# EAGLE schematic chamber_biasa (EAGLE 7.6.0)
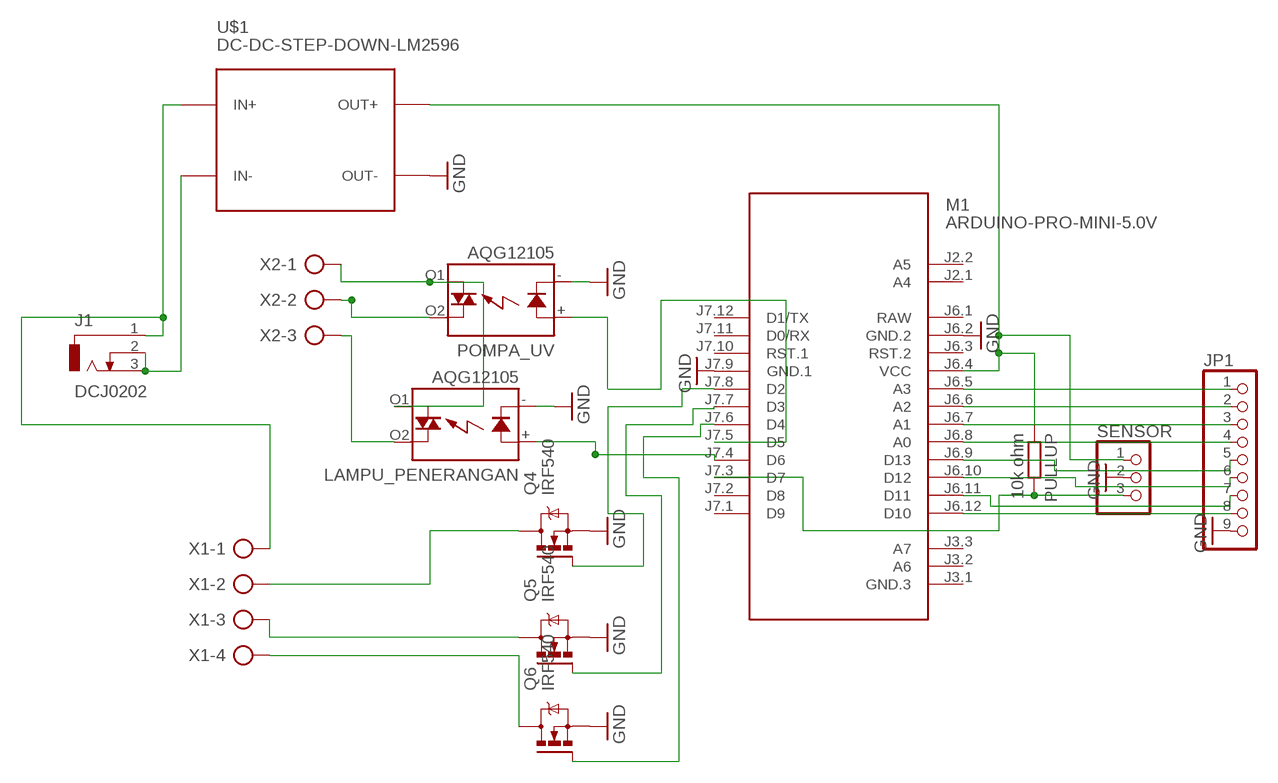
[diagram p0: schematic, sheet 1]

## Parts
J1  DCJ0202  [DCJ0202]
JP1  PINHD-1X9  [1X09]
LAMPU_PENERANGAN  AQG12105  [AQG]
M1  ARDUINO-PRO-MINI-5.0V  [ARDUINO-PRO-MINI]
POMPA_UV  AQG12105  [AQG]
PULLUP  10k ohm  R-EU_0204/7  [0204/7]
Q4  IRF540  [TO220BV]
Q5  IRF540  [TO220BV]
Q6  IRF540  [TO220BV]
SENSOR  PINHD-1X3  [1X03]
U$1  DC-DC-STEP-DOWN-LM2596  [DC-DC-STEP-DOWN-LM2596]
X1  AK300/4  [AK300/4]
X2  AK300/3  [AK300/3]

## Nets
5V: M1.J6.4(VCC) PULLUP.1 SENSOR.1 U$1.OUT+
GND: JP1.9 LAMPU_PENERANGAN.-(K) M1.J6.2(GND.2) M1.J7.9(GND.1) POMPA_UV.-(K) Q4.S Q5.S Q6.S SENSOR.2 U$1.OUT-
N$1: LAMPU_PENERANGAN.+(A) M1.J7.4(D6)
N$2: M1.J7.8(D2) Q4.G
N$3: M1.J7.5(D5) POMPA_UV.+(A)
N$4: M1.J7.7(D3) Q5.G
N$5: M1.J7.6(D4) Q6.G
N$6: Q4.D X1.2
N$7: Q5.D X1.3
N$8: Q6.D X1.4
N$9: J1.2 J1.3 U$1.IN-
N$10: J1.1 U$1.IN+ X1.1
N$11: POMPA_UV.O2(DS1) X2.2
N$12: LAMPU_PENERANGAN.O1(DS2) POMPA_UV.O1(DS2) X2.1
N$13: LAMPU_PENERANGAN.O2(DS1) X2.3
N$14: JP1.1 M1.J6.5(A3)
N$15: M1.J7.3(D7) PULLUP.2 SENSOR.3
N$16: JP1.2 M1.J6.6(A2)
N$17: JP1.3 M1.J6.7(A1)
N$18: JP1.4 M1.J6.8(A0)
N$19: JP1.5 M1.J6.9(D13)
N$20: JP1.6 M1.J6.10(D12)
N$21: JP1.7 M1.J6.11(D11)
N$22: JP1.8 M1.J6.12(D10)
Unconnected: M1.J2.1(A4) M1.J2.2(A5) M1.J3.1(GND.3) M1.J3.2(A6) M1.J3.3(A7) M1.J6.3(RST.2) M1.J7.1(D9) M1.J7.2(D8) M1.J7.10(RST.1) M1.J7.11(D0/RX) M1.J7.12(D1/TX)

## Power pins joined to a net without a drawn wire
RAW: M1.J6.1(RAW)

## Library data of the parts
J1 = con-jack:DCJ0202: DC POWER JACK Source: DCJ0202.pdf; OC_FARNELL: unknown; OC_NEWARK: unknown
JP1 = pinhead:PINHD-1X9: PIN HEADER
LAMPU_PENERANGAN POMPA_UV = relay:AQG*: SOLID STATE RELAY NAiS Zero-cross, Non zero-cross Source: http://www.mew-europe.com/.. en_ds_61611_0000.pdf; MF: AROMAT/ MATSUSHITA; MPN: AQG12105; OC_FARNELL: unknown; OC_NEWARK: 20J4759
M1 = diy-modules:ARDUINO-PRO-MINI-*: Arduino Pro Mini and compatible devices More details available here: https://www.arduino.cc/en/Main/ArduinoBoardProMini Click here to find device on ebay.com <http://www.ebay.com/sch/arduino+pro+mini>
PULLUP = rcl:R-EU_: RESISTOR, European symbol
Q4-Q6 = transistor-power:IRF540: HEXFET Power MOSFET
SENSOR = pinhead:PINHD-1X3: PIN HEADER
U$1 = diy-modules:DC-DC-STEP-DOWN-LM2596: DC/DC Step-Down Regulator based on LM2596-ADJ chip LM2596 datasheet available here: http://www.ti.com/lit/ds/symlink/lm2596.pdf Click here to find device on ebay.com <http://www.ebay.com/sch/lm2596+power+regulator>
X1 = con-ptr500:AK300/4: CONNECTOR; OC_FARNELL: unknown; OC_NEWARK: unknown
X2 = con-ptr500:AK300/3: CONNECTOR; OC_FARNELL: unknown; OC_NEWARK: unknown